# Altium schematic sheet LEDs.SchDoc
size A; SheetNumber: 4; SheetTotal: 5
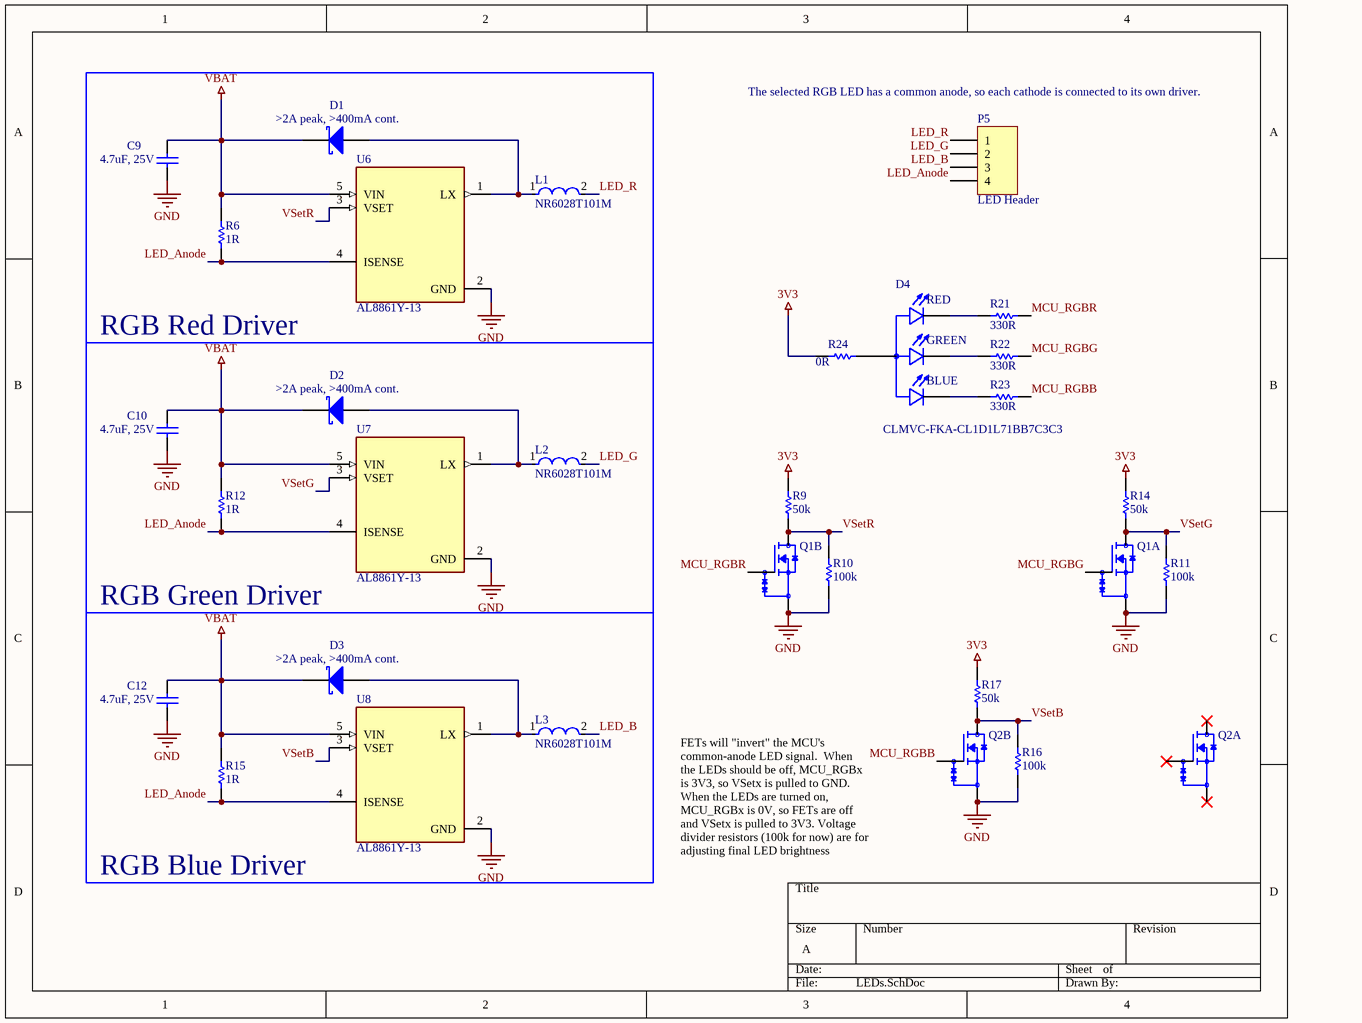
[diagram p0: LEDs.SchDoc]

## Parts
C9  value 4.7uF, 25V  [ANTC1608X90N]  (hidden comment: Capacitor)
C10  value 4.7uF, 25V  [ANTC1608X90N]  (hidden comment: Capacitor)
C12  value 4.7uF, 25V  [ANTC1608X90N]  (hidden comment: Capacitor)
D1  >2A peak, >400mA cont.  [DIO_SS26FL]
D2  >2A peak, >400mA cont.  [DIO_SS26FL]
D3  >2A peak, >400mA cont.  [DIO_SS26FL]
D4  CLMVC-FKA-CL1D1L71BB7C3C3  [LED_CLMVC-FKA-CL1D1L71BB7C3C3]
L1  NR6028T101M  [FP-NR6028-MFG]
L2  NR6028T101M  [FP-NR6028-MFG]
L3  NR6028T101M  [FP-NR6028-MFG]
P5  LED Header  [TE_350761-4]
Q1  TSM2N7002KDCU6_RFG  [SOT65P210X110-6N]  (value not drawn)  (parts A,B of 2)
Q2  TSM2N7002KDCU6_RFG  [SOT65P210X110-6N]  (value not drawn)  (parts A,B of 2)
R6  value 1R  [0603 Resistor]  (hidden comment: Resistor)
R9  value 50k  [0603 Resistor]  (hidden comment: Resistor)
R10  value 100k  [0603 Resistor]  (hidden comment: Resistor)
R11  value 100k  [0603 Resistor]  (hidden comment: Resistor)
R12  value 1R  [0603 Resistor]  (hidden comment: Resistor)
R14  value 50k  [0603 Resistor]  (hidden comment: Resistor)
R15  value 1R  [0603 Resistor]  (hidden comment: Resistor)
R16  value 100k  [0603 Resistor]  (hidden comment: Resistor)
R17  value 50k  [0603 Resistor]  (hidden comment: Resistor)
R21  value 330R  [0603 Resistor]  (hidden comment: Resistor)
R22  value 330R  [0603 Resistor]  (hidden comment: Resistor)
R23  value 330R  [0603 Resistor]  (hidden comment: Resistor)
R24  value 0R  [0603 Resistor]  (hidden comment: Resistor)
U6  AL8861Y-13  [CONV_AL8861Y-13]
U7  AL8861Y-13  [CONV_AL8861Y-13]
U8  AL8861Y-13  [CONV_AL8861Y-13]

## Blocks framed on the sheet
RGB Red Driver: C9 D1 L1 R6 U6
RGB Green Driver: C10 D2 L2 R12 U7
RGB Blue Driver: C12 D3 L3 R15 U8

## Nets
3V3: R9.2 R14.2 R17.2 R24.1
GND: C9.1 C10.1 C12.1 Q1.1(S1) Q1.4(S2) Q2.4(S2) R10.1 R11.1 R16.1 U6.2(GND) U7.2(GND) U8.2(GND)
VBAT: C9.2 C10.2 C12.2 D1.2(K) D2.2(K) D3.2(K) R6.1 R12.1 R15.1 U6.5(VIN) U7.5(VIN) U8.5(VIN)
LED_Anode: P5.4 R6.2 R12.2 R15.2 U6.4(ISENSE) U7.4(ISENSE) U8.4(ISENSE)
LED_B: L3.2 P5.3
LED_G: L2.2 P5.2
LED_R: L1.2 P5.1
MCU_RGBB: Q2.5(G2) R23.2
MCU_RGBG: Q1.2(G1) R22.2
MCU_RGBR: Q1.5(G2) R21.2
VSetB: Q2.3(D2) R16.2 R17.1 U8.3(VSET)
VSetG: Q1.6(D1) R11.2 R14.1 U7.3(VSET)
VSetR: Q1.3(D2) R9.1 R10.2 U6.3(VSET)
NetD1_1: D1.1(A) L1.1 U6.1(LX)
NetD2_1: D2.1(A) L2.1 U7.1(LX)
NetD3_1: D3.1(A) L3.1 U8.1(LX)
NetD4_1: D4.1(A) R24.2
NetD4_2: D4.2(B_C) R23.1
NetD4_3: D4.3(G_C) R22.1
NetD4_4: D4.4(R_C) R21.1

Not connected (* = marked no-connect by the designer): Q2 1(S1)* 2(G1)* 6(D1)*

## Notes on the sheet
- (near P5) The selected RGB LED has a common anode, so each cathode is connected to its own driver.
- FETs will "invert" the MCU's common-anode LED signal.  When the LEDs should be off, MCU_RGBx is 3V3, so VSetx is pulled to GND.  When the LEDs are turned on, MCU_RGBx is 0V, so FETs are off and VSetx is pulled to 3V3. Voltage divider resistors (100k for now) are for adjusting final LED brightness
- (in symbol CLMVC-FKA-CL1D1L71BB7C3C3) RED; GREEN; BLUE

## Library data of the parts
C9 C10 C12 = Capacitor: SimulationGenericComponent: True
D1-D3 = Shottky Diode: AF: 1; BV: 0; BV_MAX: 1e99; EG: 1.11; FC: 0.5; IBV: 0.001; IS: 1e-14; MJSW: 0.33; NTUN: 30; TNOM: 27; XTI: 3; SimulationGenericComponent: True; CJO: 0; CJP: 0; CTA: 0; CTP: 0; FCS: 0.5; FV_MAX: 1e99; IKF: 0; IKR: 0; ISR: 1e-14; JSW: 0; JTUN: 0; JTUNSW: 0; KEG: 1; KF: 0; LEVEL: 1; N: 1; NBV: 1; NR: 1; NS: 1; PHP: 1; RS: 0; TCV: 0; TLEV: 0; TLEVC: 0; TM1: 0; TM2: 0; TPB: 0; TPHP: 0; TRS: 0; TRS2: 0; TT: 0; TTT1: 0; TTT2: 0; VJ: 1; XTITUN: 3
D4 = CLMVC-FKA-CL1D1L71BB7C3C3: Red, Green, Blue (RGB) 622nm Red, 530nm Green, 470nm Blue LED Indication - Discrete 2V Red, 3V Green, 3V Blue 4-SMD, J-Lead; MF: Cree Inc.; SnapEDA_Link: https://www.snapeda.com/parts/CLMVC-FKA-CL1D1L71BB7C3C3/Cree%20Inc./view-part/3120624/?ref=snap; Package: SMD-4 Cree Inc.; Check_prices: https://www.snapeda.com/parts/CLMVC-FKA-CL1D1L71BB7C3C3/Cree%20Inc./view-part/3120624/?ref=eda; MP: CLMVC-FKA-CL1D1L71BB7C3C3; Value: *; Purchase-URL: https://pricing.snapeda.com/search/part/CLMVC-FKA-CL1D1L71BB7C3C3/?ref=eda; Availability: Warning; Price: None
L1-L3 = CMP-14484-001005-1: SMD Power Inductors 100uH ±20% 0.62A 0.78Ω; Self Resonant Frequency: 3MHz; RMS Current (Irms): 660mA; Shielding: Shielded; Core Material: Ferrite; Test Frequency: 100kHz; DC Resistance (DCR): 780mR; Saturation Current: 620mA; Max Operating Temperature: 120°C; Halogen Free: Halogen Free; Tolerance: 20%; Number of Pins: 2; Resistor Type: Wirewound; Length: 0.236inch; Mount: Surface Mount; Case/Package: Nonstandard; RoHS Compliant: Yes; Inductance Tolerance: 20%; Lead Free: Lead Free; Max DC Current: 660mA; Height - Seated (Max): 0.11inch; Current Rating: 660mA; Packaging: Tape and Reel; Min Operating Temperature: -25°C; Inductance: 100uH; Termination: SMD/SMT; Height: 2.8mm; Package Quantity: 2000; Series: NR; Width: 0.236inch
P5 = Header 4: Header, 4-Pin; LatestRevisionDate: 17-Jul-2002; LatestRevisionNote: Re-released for DXP Platform.; Publisher: Altium Limited
Q1 Q2 = TSM2N7002KDCU6_RFG: 60V, 0.22A, Dual N-Channel Power MOSFET; MF: Taiwan Semiconductor; MP: TSM2N7002KDCU6 RFG; Value: *; Check_prices: https://www.snapeda.com/parts/TSM2N7002KDCU6%20RFG/Taiwan+Semiconductor/view-part/?ref=eda; Price: None; SnapEDA_Link: https://www.snapeda.com/parts/TSM2N7002KDCU6%20RFG/Taiwan+Semiconductor/view-part/?ref=snap; Availability: In Stock; Package: None
R6 R9-R12 R14-R17 R21-R24 = Resistor: TC1: 0; SimulationGenericComponent: True; TC2: 0
U6-U8 = AL8861Y-13: LED Driver IC 1 Output DC DC Regulator Step-Down _Buck_ Analog, PWM Dimming 1.5A SOT-89-5; MF: Diodes Inc.; Availability: Unavailable; SnapEDA_Link: https://www.snapeda.com/parts/AL8861Y-13/Diodes%20Inc./view-part/1241445/?ref=snap; MP: AL8861Y-13; Price: None; Package: SOT-89 Diodes Inc.; Value: *